# EAGLE design adapter-pcb (EAGLE 6.5.0)
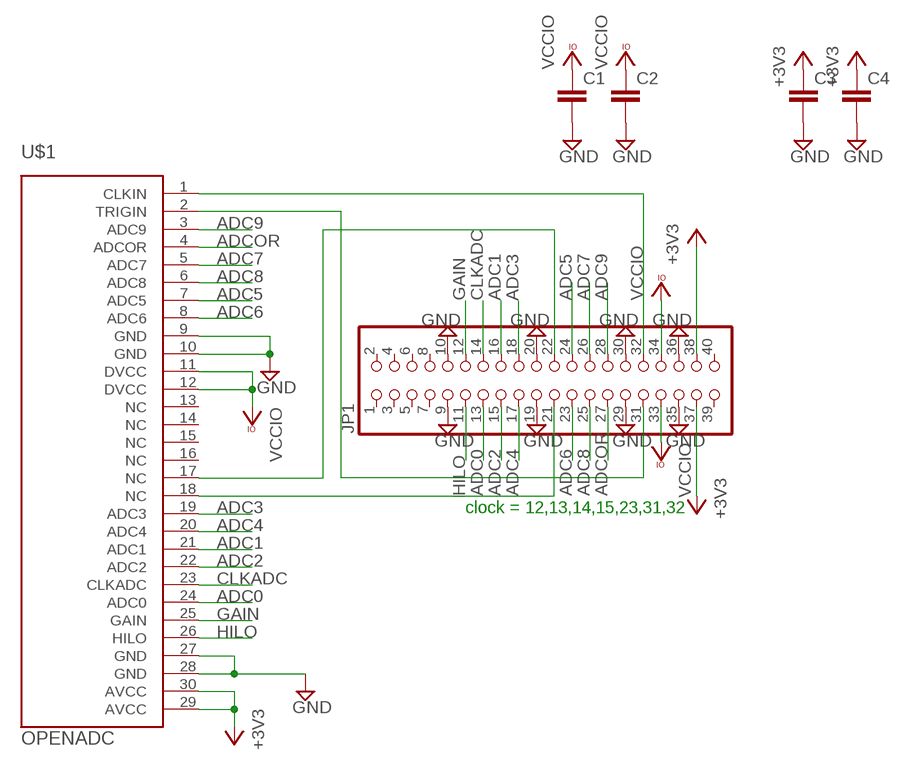
[diagram p0: schematic, sheet 1]

## Parts
C1  C-EUC0805  [C0805]
C2  C-EUC0805  [C0805]
C3  C-EUC0805  [C0805]
C4  C-EUC0805  [C0805]
JP1  PINHD-2X20  [2X20]
U$1  OPENADC  [OPENADCREV1]

## Nets
+3V3: C3.1 C4.1 JP1.37 JP1.38 U$1.29(AVCC) U$1.30(AVCC)
ADC0: JP1.13 U$1.24(ADC0)
ADC1: JP1.16 U$1.21(ADC1)
ADC2: JP1.15 U$1.22(ADC2)
ADC3: JP1.18 U$1.19(ADC3)
ADC4: JP1.17 U$1.20(ADC4)
ADC5: JP1.24 U$1.7(ADC5)
ADC6: JP1.23 U$1.8(ADC6)
ADC7: JP1.26 U$1.5(ADC7)
ADC8: JP1.25 U$1.6(ADC8)
ADC9: JP1.28 U$1.3(ADC9)
ADCOR: JP1.27 U$1.4(ADCOR)
CLKADC: JP1.14 U$1.23(CLKADC)
GAIN: JP1.12 U$1.25(GAIN)
GND: C1.2 C2.2 C3.2 C4.2 JP1.9 JP1.10 JP1.19 JP1.20 JP1.29 JP1.30 JP1.35 JP1.36 U$1.9(GND) U$1.10(GND) U$1.27(GND) U$1.28(GND)
HILO: JP1.11 U$1.26(HILO)
N$1: JP1.32 U$1.1(CLKIN)
N$2: JP1.31 U$1.2(TRIGIN)
N$3: JP1.21 U$1.18(NC)
N$4: JP1.22 U$1.17(NC)
VCCIO: C1.1 C2.1 JP1.33 JP1.34 U$1.11(DVCC) U$1.12(DVCC)
Unconnected: JP1.1 JP1.2 JP1.3 JP1.4 JP1.5 JP1.6 JP1.7 JP1.8 JP1.39 JP1.40 U$1.13(NC) U$1.14(NC) U$1.15(NC) U$1.16(NC)

## Notes on the sheet
- clock = 12,13,14,15,23,31,32

## Library data of the parts
C1-C4 = rcl:C-EU: CAPACITOR, European symbol
JP1 = pinhead:PINHD-2X20: PIN HEADER
U$1 = openadc_footprint:OPENADC

## Board
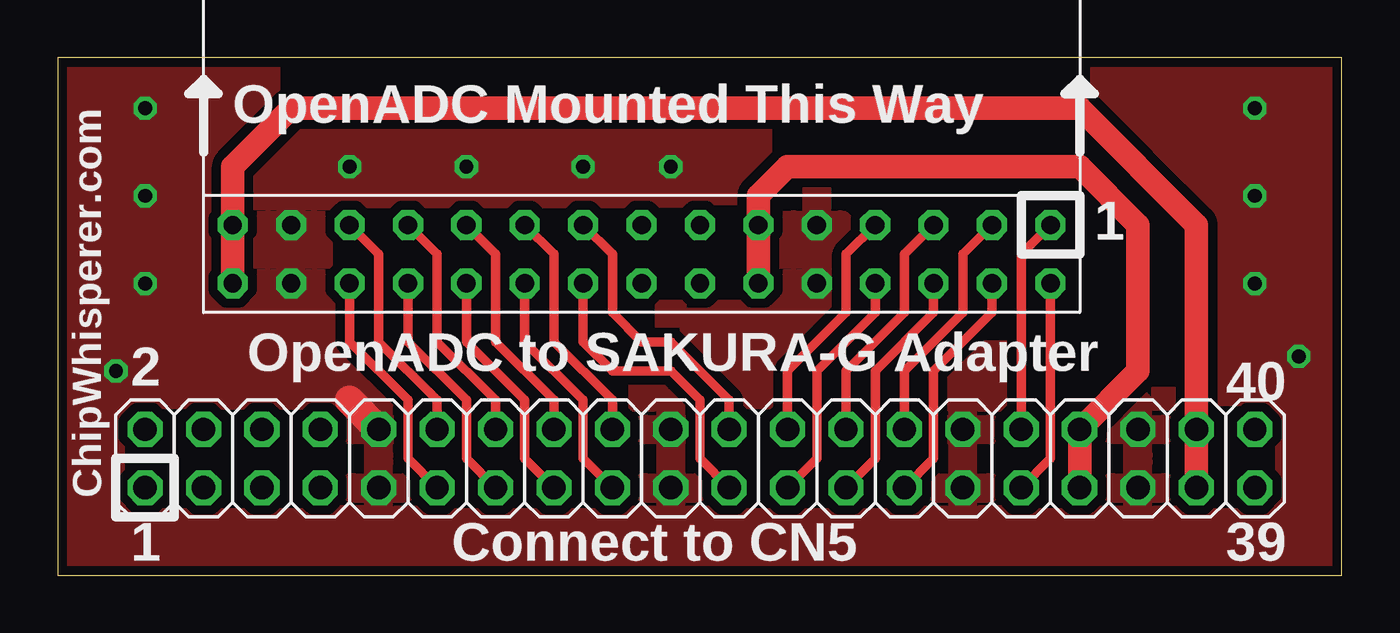
[diagram p1: board, top side]
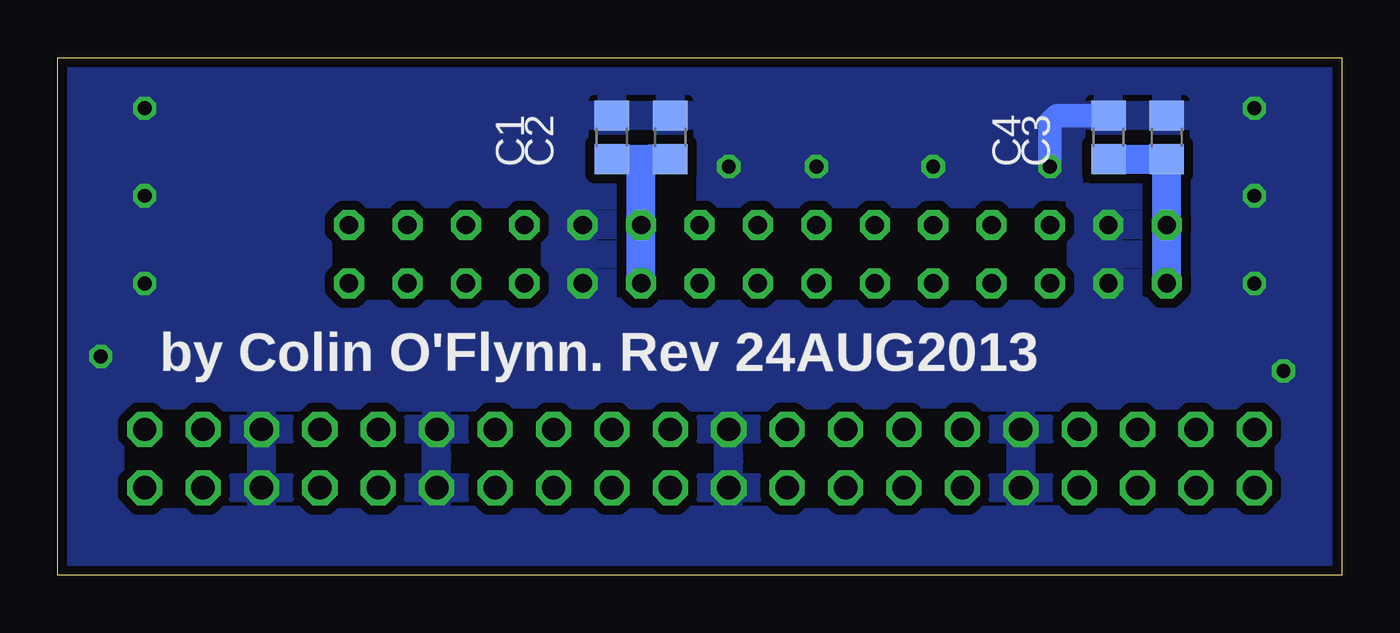
[diagram p2: board, bottom side, seen from below]

Size 55.86 x 22.53 mm. Coordinates in mm from the lower left corner, seen from the top.
Outline: 0,0 55.86,0 55.86,22.53 0,22.53 0,0
Copper layers (1*16): Top 0.035mm / dielectric 1.5mm / Bottom 0.035mm
Design rules "default *": minimum track width 10mil, minimum drill 24mil, track to track 8mil, track to pad 8mil, pad to pad 8mil, via to via 8mil, smd to smd 8mil, copper to edge 10mil, drill to drill 8mil, minimum pad ring 10mil, minimum via ring 8mil, stop-mask expansion 4mil, vias tented up to drill 0mil, thermal gap 10mil

### Footprints (pad centres in the part's own frame; a part is rotated, then mirrored left to right if it is on the bottom)
C0805 = smd 1.3 x 1.5: 1 -0.95,0; 2 0.95,0
2X20 = drill 1.016 octagon: 1 -24.13,-1.27; 2 -24.13,1.27; 3 -21.59,-1.27; 4 -21.59,1.27; 5 -19.05,-1.27; 6 -19.05,1.27; 7 -16.51,-1.27; 8 -16.51,1.27; 9 -13.97,-1.27; 10 -13.97,1.27; 11 -11.43,-1.27; 12 -11.43,1.27; 13 -8.89,-1.27; 14 -8.89,1.27; 15 -6.35,-1.27; 16 -6.35,1.27; 17 -3.81,-1.27; 18 -3.81,1.27; 19 -1.27,-1.27; 20 -1.27,1.27; 21 1.27,-1.27; 22 1.27,1.27; 23 3.81,-1.27; 24 3.81,1.27; 25 6.35,-1.27; 26 6.35,1.27; 27 8.89,-1.27; 28 8.89,1.27; 29 11.43,-1.27; 30 11.43,1.27; 31 13.97,-1.27; 32 13.97,1.27; 33 16.51,-1.27; 34 16.51,1.27; 35 19.05,-1.27; 36 19.05,1.27; 37 21.59,-1.27; 38 21.59,1.27; 39 24.13,-1.27; 40 24.13,1.27
OPENADCREV1 = drill 0.8 octagon: 1 0,17.78; 2 2.54,17.78; 3 0,15.24; 4 2.54,15.24; 5 0,12.7; 6 2.54,12.7; 7 0,10.16; 8 2.54,10.16; 9 0,7.62; 10 2.54,7.62; 11 0,5.08; 12 2.54,5.08; 13 0,2.54; 14 2.54,2.54; 15 0,0; 16 2.54,0; 17 0,-2.54; 18 2.54,-2.54; 19 0,-5.08; 20 2.54,-5.08; 21 0,-7.62; 22 2.54,-7.62; 23 0,-10.16; 24 2.54,-10.16; 25 0,-12.7; 26 2.54,-12.7; 27 0,-15.24; 28 2.54,-15.24; 29 0,-17.78; 30 2.54,-17.78

### Placement (x,y rotation side)
C1  31.75,19.05 90 bottom
C2  29.21,19.05 90 bottom
C3  7.62,19.05 90 bottom
C4  10.16,19.05 90 bottom
JP1  27.94,5.08 0 top
U$1  25.4,15.24 270 top

### Tracks (layer width: path | path; a pad name or v marks a point on that pad's centre or on a via)
+3V3
  Top 1.016: U$1.30 U$1.29 7.62,17.78 10.16,20.32 44.45,20.32 49.53,15.24 JP1.38 JP1.37
  Bottom 1.27: U$1.30 U$1.29 C3.1 C4.1
ADC0
  Top 0.406: JP1.13 17.78,5.08 17.78,7.62 15.24,10.16 U$1.24
ADC1
  Top 0.406: JP1.16 21.59,7.62 19.05,10.16 19.05,13.97 U$1.21
ADC2
  Top 0.406: JP1.15 20.32,5.08 20.32,7.62 17.78,10.16 U$1.22
ADC3
  Top 0.406: JP1.18 24.13,7.62 21.59,10.16 21.59,13.97 U$1.19
ADC4
  Top 0.406: JP1.17 22.86,5.08 22.86,7.62 20.32,10.16 U$1.20
ADC5
  Top 0.406: JP1.24 31.75,8.89 34.29,11.43 34.29,13.97 U$1.7
ADC6
  Top 0.406: JP1.23 33.02,5.08 33.02,8.89 35.56,11.43 U$1.8
ADC7
  Top 0.406: JP1.26 34.29,8.89 36.83,11.43 36.83,13.97 U$1.5
ADC8
  Top 0.406: JP1.25 35.56,5.08 35.56,8.89 38.1,11.43 U$1.6
ADC9
  Top 0.406: JP1.28 36.83,8.89 39.37,11.43 39.37,13.97 U$1.3
ADCOR
  Top 0.406: JP1.27 38.1,5.08 38.1,8.89 40.64,11.43 U$1.4
CLKADC
  Top 0.406: JP1.14 19.05,7.62 16.51,10.16 16.51,13.97 U$1.23
GAIN
  Top 0.406: U$1.25 13.97,13.97 13.97,10.16 16.51,7.62 JP1.12
GND  (via drill 0.6)
  Top 1.27: JP1.10 12.7,7.62
  Bottom 1.016: C4.2 12.38,20 12.7,19.68 v12.7,17.78
  other vias: 53.98,9.53 52.07,16.51 52.07,12.7 52.07,20.32 3.81,20.32 3.81,12.7 3.81,16.51 2.54,8.89 26.67,17.78 22.86,17.78 17.78,17.78
  pour Bottom (isolate 0.406): 0,22.86 55.88,22.86 55.88,0 -1.27,0 -1.27,21.59
  pour Top (isolate 0.406): 0,22.86 55.88,22.86 55.88,0 -1.27,0 -1.27,21.59
HILO
  Top 0.406: JP1.11 15.24,5.08 15.24,7.62 12.7,10.16 U$1.26
N$1
  Top 0.406: JP1.32 41.91,13.97 U$1.1
N$2
  Top 0.406: JP1.31 43.18,5.08 U$1.2
N$3
  Top 0.406: JP1.21 27.94,5.08 27.94,7.62 26.67,8.89 24.13,8.89 22.86,10.16 U$1.18
N$4
  Top 0.406: JP1.22 29.21,7.62 26.67,10.16 25.4,10.16 24.13,11.43 24.13,13.97 U$1.17
VCCIO
  Top 1.016: JP1.33 JP1.34 46.99,8.89 46.99,15.24 44.45,17.78 31.75,17.78 30.48,16.51 U$1.11 U$1.12
  Bottom 1.27: U$1.12 U$1.11 30.48,17.78 30.16,18.1 C2.1 C1.1

### Text on the board
tPlace: ChipWhisperer.com | OpenADC Mounted This Way | 1 | OpenADC to SAKURA-G Adapter | 2 | 40 | 1 | Connect to CN5 | 39
bPlace: by Colin O'Flynn. Rev 24AUG2013